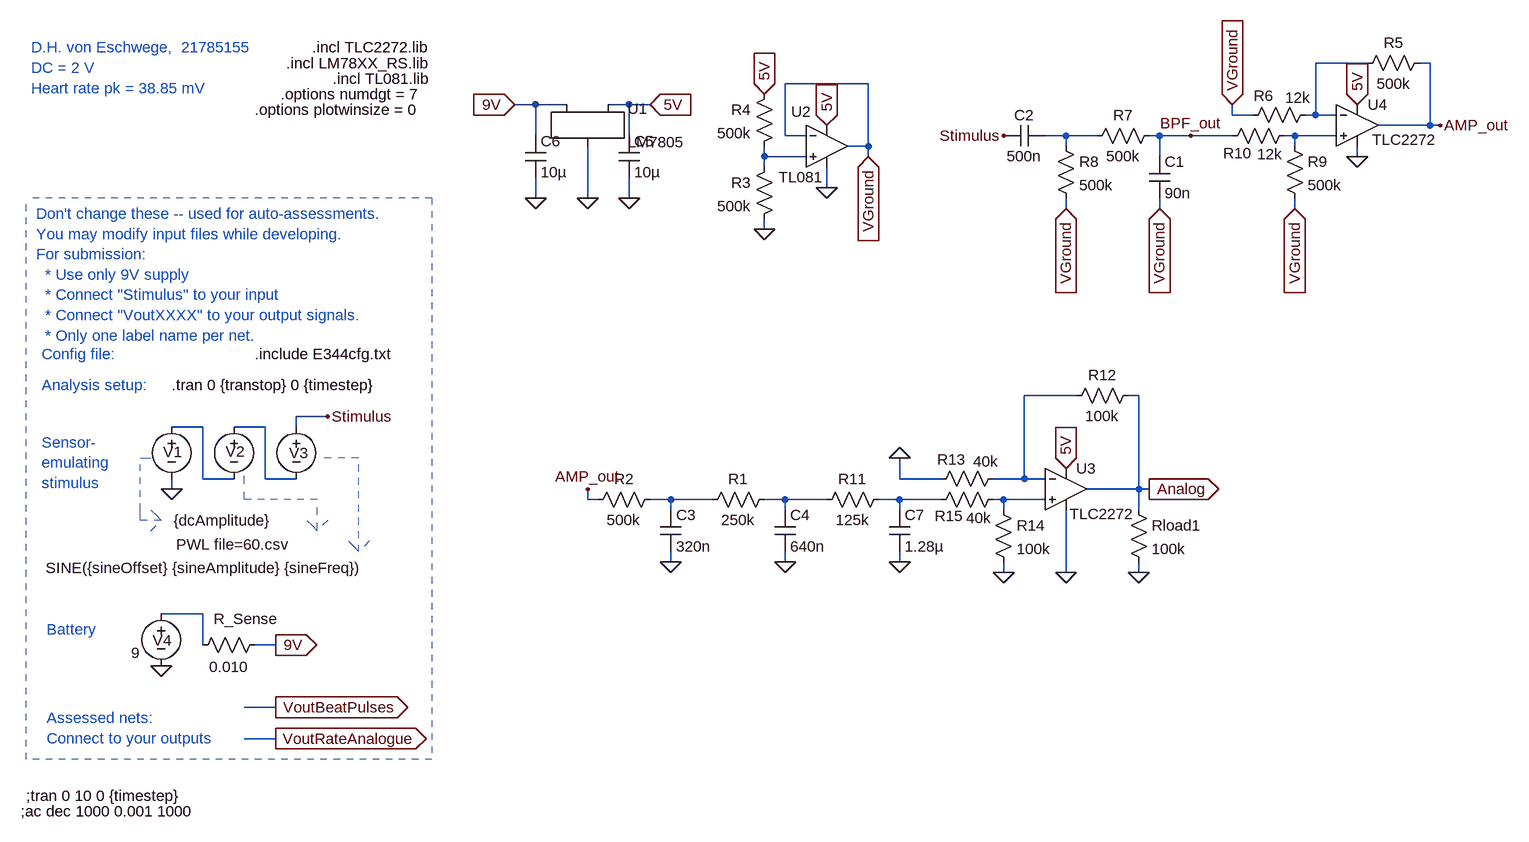
[diagram p0: schematic X_2ndOrderBPF_Schmitt_Bruh_CurrentWorking.asc]
X_2ndOrderBPF_Schmitt_Bruh_CurrentWorking.asc, the LTspice schematic file:
Version 4
SHEET 1 1824 680
WIRE -240 -1616 -320 -1616
WIRE -144 -1616 -160 -1616
WIRE -1008 -1584 -1136 -1584
WIRE -1520 -1552 -1552 -1552
WIRE -1472 -1552 -1520 -1552
WIRE -1376 -1552 -1408 -1552
WIRE -1344 -1552 -1376 -1552
WIRE -448 -1536 -448 -1552
WIRE -416 -1536 -448 -1536
WIRE -320 -1536 -320 -1616
WIRE -320 -1536 -336 -1536
WIRE -288 -1536 -320 -1536
WIRE -144 -1520 -144 -1616
WIRE -144 -1520 -224 -1520
WIRE -128 -1520 -144 -1520
WIRE -1520 -1504 -1520 -1552
WIRE -1376 -1504 -1376 -1552
WIRE -1136 -1504 -1136 -1584
WIRE -1104 -1504 -1136 -1504
WIRE -704 -1504 -736 -1504
WIRE -656 -1504 -704 -1504
WIRE -560 -1504 -576 -1504
WIRE -512 -1504 -560 -1504
WIRE -448 -1504 -512 -1504
WIRE -352 -1504 -368 -1504
WIRE -288 -1504 -352 -1504
WIRE -1008 -1488 -1008 -1584
WIRE -1008 -1488 -1040 -1488
WIRE -704 -1488 -704 -1504
WIRE -352 -1488 -352 -1504
WIRE -1168 -1472 -1168 -1488
WIRE -1104 -1472 -1168 -1472
WIRE -1008 -1472 -1008 -1488
WIRE -560 -1472 -560 -1504
WIRE -256 -1472 -256 -1488
WIRE -1168 -1456 -1168 -1472
WIRE -1072 -1424 -1072 -1456
WIRE -1520 -1408 -1520 -1440
WIRE -1440 -1408 -1440 -1488
WIRE -1376 -1408 -1376 -1440
WIRE -704 -1392 -704 -1408
WIRE -560 -1392 -560 -1408
WIRE -352 -1392 -352 -1408
WIRE -1168 -1360 -1168 -1376
WIRE -688 -1104 -768 -1104
WIRE -592 -1104 -608 -1104
WIRE -1840 -1072 -1888 -1072
WIRE -2032 -1056 -2080 -1056
WIRE -1936 -1056 -1984 -1056
WIRE -1888 -1056 -1888 -1072
WIRE -2032 -976 -2032 -1056
WIRE -1984 -976 -2032 -976
WIRE -1936 -976 -1936 -1056
WIRE -1888 -976 -1936 -976
WIRE -960 -976 -960 -1008
WIRE -896 -976 -960 -976
WIRE -768 -976 -768 -1104
WIRE -768 -976 -816 -976
WIRE -736 -976 -768 -976
WIRE -2080 -960 -2080 -976
WIRE -592 -960 -592 -1104
WIRE -592 -960 -672 -960
WIRE -576 -960 -592 -960
WIRE -1440 -944 -1440 -960
WIRE -1424 -944 -1440 -944
WIRE -1312 -944 -1344 -944
WIRE -1248 -944 -1312 -944
WIRE -1136 -944 -1168 -944
WIRE -1072 -944 -1136 -944
WIRE -960 -944 -992 -944
WIRE -896 -944 -960 -944
WIRE -800 -944 -816 -944
WIRE -736 -944 -800 -944
WIRE -1312 -928 -1312 -944
WIRE -1136 -928 -1136 -944
WIRE -960 -928 -960 -944
WIRE -800 -928 -800 -944
WIRE -592 -928 -592 -960
WIRE -1312 -848 -1312 -864
WIRE -1136 -848 -1136 -864
WIRE -960 -848 -960 -864
WIRE -800 -832 -800 -848
WIRE -704 -832 -704 -928
WIRE -592 -832 -592 -848
WIRE -2032 -768 -2096 -768
WIRE -2032 -720 -2032 -768
WIRE -1920 -720 -1952 -720
WIRE -1920 -624 -1968 -624
WIRE -1920 -576 -1968 -576
FLAG -2080 -960 0
FLAG -1840 -1072 Stimulus
FLAG -1920 -720 9V
IOPIN -1920 -720 Out
FLAG -2096 -688 0
FLAG -1920 -624 VoutBeatPulses
IOPIN -1920 -624 Out
FLAG -1920 -576 VoutRateAnalogue
IOPIN -1920 -576 Out
FLAG -256 -1472 0
FLAG -512 -1504 BPF_out
FLAG -256 -1552 5V
IOPIN -256 -1552 In
FLAG -800 -1504 Stimulus
FLAG -704 -1392 VGround
IOPIN -704 -1392 In
FLAG -560 -1392 VGround
IOPIN -560 -1392 In
FLAG -352 -1392 VGround
IOPIN -352 -1392 In
FLAG -448 -1552 VGround
IOPIN -448 -1552 In
FLAG -1440 -960 AMP_out
FLAG -128 -1520 AMP_out
FLAG -1440 -1408 0
FLAG -1552 -1552 9V
IOPIN -1552 -1552 In
FLAG -1520 -1408 0
FLAG -1376 -1408 0
FLAG -1344 -1552 5V
IOPIN -1344 -1552 In
FLAG -1168 -1360 0
FLAG -1168 -1568 5V
IOPIN -1168 -1568 In
FLAG -1072 -1424 0
FLAG -1072 -1520 5V
IOPIN -1072 -1520 In
FLAG -1008 -1472 VGround
IOPIN -1008 -1472 In
FLAG -576 -960 Analog
IOPIN -576 -960 Out
FLAG -592 -832 0
FLAG -704 -832 0
FLAG -800 -832 0
FLAG -704 -992 5V
IOPIN -704 -992 In
FLAG -960 -1008 0
FLAG -960 -848 0
FLAG -1136 -848 0
FLAG -1312 -848 0
SYMBOL voltage -1984 -1072 R0
WINDOW 123 0 0 Left 0
WINDOW 39 0 0 Left 0
WINDOW 3 -89 197 Left 2
WINDOW 0 -13 54 Left 2
SYMATTR Value PWL file=60.csv
SYMATTR InstName V2
SYMBOL voltage -1888 -1072 R0
WINDOW 123 24 44 Left 2
WINDOW 39 0 0 Left 0
WINDOW 3 -386 233 Left 2
WINDOW 0 -11 56 Left 2
SYMATTR Value SINE({sineOffset} {sineAmplitude} {sineFreq})
SYMATTR InstName V3
SYMBOL voltage -2080 -1072 R0
WINDOW 123 0 0 Left 0
WINDOW 39 0 0 Left 0
WINDOW 3 3 160 Left 2
WINDOW 0 -13 55 Left 2
SYMATTR Value {dcAmplitude}
SYMATTR InstName V1
SYMBOL voltage -2096 -784 R0
WINDOW 123 24 44 Left 2
WINDOW 39 0 0 Left 0
WINDOW 3 -46 76 Left 2
WINDOW 0 -13 57 Left 2
SYMATTR Value 9
SYMATTR InstName V4
SYMBOL res -1936 -736 R90
WINDOW 0 -9 30 VBottom 2
WINDOW 3 34 56 VTop 2
SYMATTR InstName R_Sense
SYMATTR Value 0.010
SYMBOL res -144 -1632 R90
WINDOW 0 0 56 VBottom 2
WINDOW 3 32 56 VTop 2
SYMATTR InstName R5
SYMATTR Value 500k
SYMBOL res -320 -1552 R90
WINDOW 0 2 80 VBottom 2
WINDOW 3 -26 27 VTop 2
SYMATTR InstName R6
SYMATTR Value 12k
SYMBOL Opamps\\opamp2 -256 -1584 R0
WINDOW 3 23 86 Left 2
SYMATTR Value TLC2272
SYMATTR InstName U4
SYMBOL res -368 -1504 R0
SYMATTR InstName R9
SYMATTR Value 500k
SYMBOL res -352 -1520 R90
WINDOW 0 58 88 VBottom 2
WINDOW 3 29 38 VTop 2
SYMATTR InstName R10
SYMATTR Value 12k
SYMBOL res -560 -1520 R90
WINDOW 0 0 56 VBottom 2
WINDOW 3 32 56 VTop 2
SYMATTR InstName R7
SYMATTR Value 500k
SYMBOL cap -576 -1472 R0
SYMATTR InstName C1
SYMATTR Value 90n
SYMBOL cap -736 -1488 M270
WINDOW 0 32 32 VTop 2
WINDOW 3 0 32 VBottom 2
SYMATTR InstName C2
SYMATTR Value 500n
SYMBOL res -720 -1504 R0
SYMATTR InstName R8
SYMATTR Value 500k
SYMBOL res -1328 -960 R90
WINDOW 0 0 56 VBottom 2
WINDOW 3 32 56 VTop 2
SYMATTR InstName R2
SYMATTR Value 500k
SYMBOL LM7805 -1440 -1536 R0
SYMATTR InstName U1
SYMBOL cap -1392 -1504 R0
SYMATTR InstName C5
SYMATTR Value 10µ
SYMBOL cap -1536 -1504 R0
SYMATTR InstName C6
SYMATTR Value 10µ
SYMBOL res -1152 -1472 M0
SYMATTR InstName R3
SYMATTR Value 500k
SYMBOL res -1152 -1584 M0
SYMATTR InstName R4
SYMATTR Value 500k
SYMBOL Opamps\\opamp2 -1072 -1552 R0
WINDOW 0 -55 11 Left 2
WINDOW 3 -74 112 Left 2
SYMATTR InstName U2
SYMATTR Value TL081
SYMBOL cap -1328 -928 R0
SYMATTR InstName C3
SYMATTR Value 320n
SYMBOL res -1152 -960 R90
WINDOW 0 0 56 VBottom 2
WINDOW 3 32 56 VTop 2
SYMATTR InstName R1
SYMATTR Value 250k
SYMBOL cap -1152 -928 R0
SYMATTR InstName C4
SYMATTR Value 640n
SYMBOL res -976 -960 R90
WINDOW 0 0 56 VBottom 2
WINDOW 3 32 56 VTop 2
SYMATTR InstName R11
SYMATTR Value 125k
SYMBOL cap -976 -928 R0
SYMATTR InstName C7
SYMATTR Value 1.28µ
SYMBOL res -608 -944 R0
SYMATTR InstName Rload1
SYMATTR Value 100k
SYMBOL res -592 -1120 R90
WINDOW 0 0 56 VBottom 2
WINDOW 3 32 56 VTop 2
SYMATTR InstName R12
SYMATTR Value 100k
SYMBOL res -800 -992 R90
WINDOW 0 2 80 VBottom 2
WINDOW 3 -26 27 VTop 2
SYMATTR InstName R13
SYMATTR Value 40k
SYMBOL Opamps\\opamp2 -704 -1024 R0
WINDOW 3 6 102 Left 2
SYMATTR Value TLC2272
SYMATTR InstName U3
SYMBOL res -816 -944 R0
SYMATTR InstName R14
SYMATTR Value 100k
SYMBOL res -800 -960 R90
WINDOW 0 57 84 VBottom 2
WINDOW 3 29 38 VTop 2
SYMATTR InstName R15
SYMATTR Value 40k
TEXT -2080 -1120 Left 2 !.tran 0 {transtop} 0 {timestep}
TEXT -1952 -1168 Left 2 !.include E344cfg.txt
TEXT -2288 -1384 Left 2 ;Don't change these -- used for auto-assessments.\nYou may modify input files while developing.\nFor submission: \n  * Use only 9V supply \n  * Connect "Stimulus" to your input\n  * Connect "VoutXXXX" to your output signals.\n  * Only one label name per net.
TEXT -2280 -1168 Left 2 ;Config file:
TEXT -2280 -1120 Left 2 ;Analysis setup:
TEXT -2272 -744 Left 2 ;Battery
TEXT -2280 -1032 Left 2 ;Sensor-\nemulating \nstimulus
TEXT -2272 -608 Left 2 ;Assessed nets:\nConnect to your outputs
TEXT -2296 -1640 Left 2 ;D.H. von Eschwege,  21785155\nDC = 2 V\nHeart rate pk = 38.85 mV
TEXT -1864 -1640 Left 2 !.incl TLC2272.lib
TEXT -1904 -1616 Left 2 !.incl LM78XX_RS.lib
TEXT -1832 -1592 Left 2 !.incl TL081.lib
TEXT -1912 -1568 Left 2 !.options numdgt = 7
TEXT -1952 -1544 Left 2 !.options plotwinsize = 0
TEXT -2312 -464 Left 2 !;ac dec 1000 0.001 1000
TEXT -2304 -488 Left 2 !;tran 0 10 0 {timestep}
LINE Normal -1792 -1008 -1856 -1008 2
LINE Normal -1792 -864 -1792 -1008 2
LINE Normal -1808 -880 -1792 -864 2
LINE Normal -1792 -864 -1808 -880 2
LINE Normal -1776 -880 -1792 -864 2
LINE Normal -2128 -1008 -2112 -1008 2
LINE Normal -2128 -928 -2128 -1008 2
LINE Normal -2128 -912 -2128 -928 2
LINE Normal -2096 -912 -2128 -912 2
LINE Normal -2112 -928 -2096 -912 2
LINE Normal -2096 -912 -2112 -928 2
LINE Normal -2112 -896 -2096 -912 2
LINE Normal -1968 -944 -1968 -992 2
LINE Normal -1856 -944 -1968 -944 2
LINE Normal -1856 -896 -1856 -944 2
LINE Normal -1872 -912 -1856 -896 2
LINE Normal -1856 -896 -1872 -912 2
LINE Normal -1840 -912 -1856 -896 2
LINE Normal -2304 -544 -2304 -1408 1
LINE Normal -1680 -1408 -1680 -544 1
LINE Normal -1680 -544 -2304 -544 1
LINE Normal -1680 -1408 -2304 -1408 1

The netlist it stands for:
* X_2ndOrderBPF_Schmitt_Bruh_CurrentWorking.asc
V2 N007 N006 PWL file=60.csv
V3 Stimulus N007 SINE({sineOffset} {sineAmplitude} {sineFreq})
V1 N006 0 {dcAmplitude}
V4 N012 0 9
R_Sense 9V N012 0.010
R5 AMP_out N001 500k
R6 N001 VGround 12k
XU4 N003 N001 5V 0 AMP_out TLC2272  ; pins In+ In- V+ V- OUT
R9 N003 VGround 500k
R10 N003 BPF_out 12k
R7 BPF_out N002 500k
C1 BPF_out VGround 90n
C2 N002 Stimulus 500n
R8 N002 VGround 500k
R2 N008 AMP_out 500k
XU1 9V 0 5V LM7805
C5 5V 0 10µ
C6 9V 0 10µ
R3 N004 0 500k
R4 5V N004 500k
XU2 N004 VGround 5V 0 VGround TL081  ; pins In+ In- V+ V- OUT
C3 N008 0 320n
R1 N009 N008 250k
C4 N009 0 640n
R11 N010 N009 125k
C7 N010 0 1.28µ
Rload1 Analog 0 100k
R12 Analog N005 100k
R13 N005 0 40k
XU3 N011 N005 5V 0 Analog TLC2272  ; pins In+ In- V+ V- OUT
R14 N011 0 100k
R15 N011 N010 40k
.tran 0 {transtop} 0 {timestep}
.include E344cfg.txt
* Don't change these -- used for auto-assessments.
* You may modify input files while developing.
* For submission:
*   * Use only 9V supply
*   * Connect "Stimulus" to your input
*   * Connect "VoutXXXX" to your output signals.
*   * Only one label name per net.
* Config file:
* Analysis setup:
* Battery
* Sensor-
* emulating
* stimulus
* Assessed nets:
* Connect to your outputs
* D.H. von Eschwege,  21785155
* DC = 2 V
* Heart rate pk = 38.85 mV
.incl TLC2272.lib
.incl LM78XX_RS.lib
.incl TL081.lib
.options numdgt = 7
.options plotwinsize = 0
;ac dec 1000 0.001 1000
;tran 0 10 0 {timestep}
.backanno
.end